# Altium schematic sheet ADCIN_Matching5GHz_forACC.SchDoc
size A3
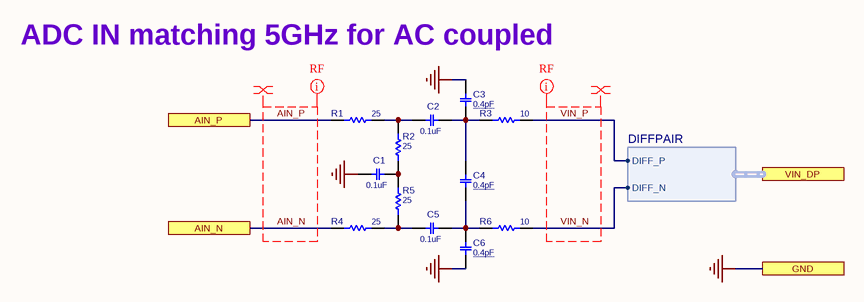
[diagram p0: ADCIN_Matching5GHz_forACC.SchDoc]

## Parts
C1  0.1uF  [C0402]
C2  0.1uF  [C0402]
C3  0.4pF  [C0402]
C4  0.4pF  [C0402]
C5  0.1uF  [C0402]
C6  0.4pF  [C0402]
R1  25  [R0402]
R2  25  [R0402]
R3  10  [R0402]
R4  25  [R0402]
R5  25  [R0402]
R6  10  [R0402]

## Ports
AIN_N, AIN_P, GND, VIN_DP (harness DIFFPAIR)

## Harnesses
DIFFPAIR: DIFF_N, DIFF_P

## Nets
GND: C1.1 C3.1 C6.1 ; port GND
AIN_N: R4.2 ; port AIN_N
AIN_P: R1.2 ; port AIN_P
VIN_N: R6.1 ; port VIN_DP.DIFF_N
VIN_P: R3.1 ; port VIN_DP.DIFF_P
NetC1_2: C1.2 R2.2 R5.1
NetC2_1: C2.1 R1.1 R2.1
NetC2_2: C2.2 C3.2 C4.1 R3.2
NetC4_2: C4.2 C5.2 C6.2 R6.2
NetC5_1: C5.1 R4.1 R5.2

## Layout directives
net class RF: AIN_N, AIN_P, VIN_N, VIN_P
differential pair: AIN_N, AIN_P, VIN_N, VIN_P

## Notes on the sheet
- (near C3) ADC IN matching 5GHz for AC coupled
- Title
- Size:
- Date:
- A3
- Number:
- Time:
- Revision:
- Sheet
- of
- File:

## Library data of the parts
C1 C2 C5 = CAP_SMD_MLCC_100n50T: CAP, MLCC; PARAM: 50V; PARAM2: X5R, 10%; MANF_P#: -; MANF: -; DESC: -; ASSEMBLY: ASSEMBLY; PRICE: 100= 5$; VALUE: 0.1uF
C3 C4 C6 = CAP_SMD_MLCC_100n50T: CAP, MLCC; PARAM: 50V; MANF_P#: -; MANF: -; DESC: -; PARAM2: -; ASSEMBLY: ASSEMBLY; PRICE: 100= 5$; VALUE: 0.4pF
R1-R6 = RES_SMD_10K_0402: RESISTOR, SMD; PARAM: 0.063W; DESC: DESCRIPTION; DIST#: MOUSER; PARAM2: 1%; MANF: -; ASSEMBLY: ASSEMBLY; PRICE: 100= 0.3$; MANF_P#: -
  R1 R2 R4 R5: VALUE: 25
  R3 R6: VALUE: 10